# EAGLE design avrusb500 (EAGLE 6.1)
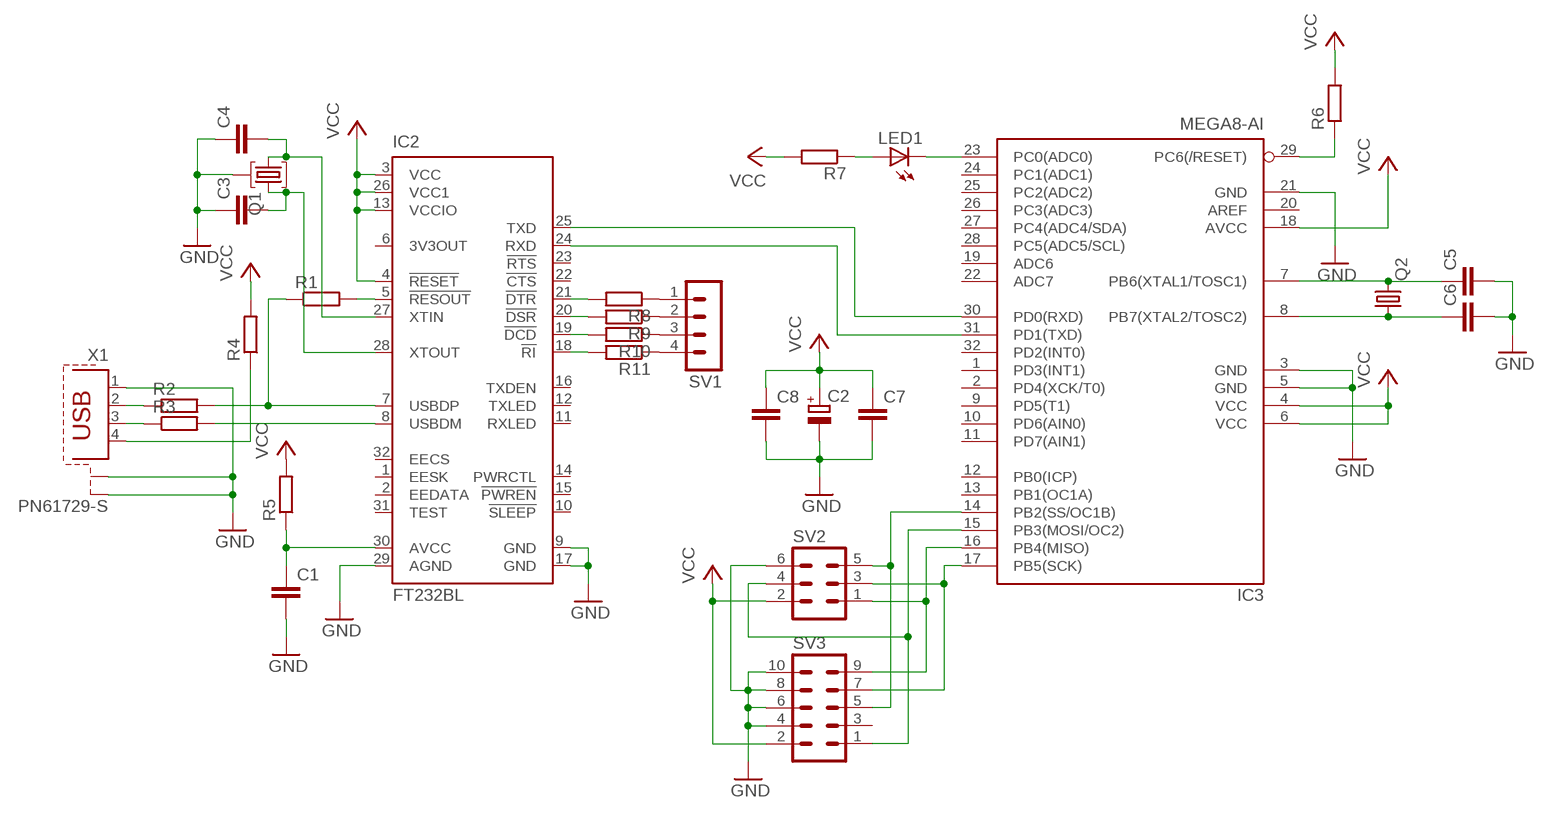
[diagram p0: schematic, sheet 1]

## Parts
C1  C-EUC0805  [C0805]
C2  CPOL-EUSMCB  [SMC_B]
C3  C-EUC0805  [C0805]
C4  C-EUC0805  [C0805]
C5  C-EUC0805  [C0805]
C6  C-EUC0805  [C0805]
C7  C-EUC0805  [C0805]
C8  C-EUC0805  [C0805]
IC2  FT232BL  [LQFP32-7X7]
IC3  MEGA8-AI  [TQFP32-08]
LED1  LED5MM  [LED5MM]
Q1  HC49TL-H  [HC49TL-H]
Q2  CRYSTALHC49UP  [HC49UP]
R1  R-EU_R0805  [R0805]
R2  R-EU_R0805  [R0805]
R3  R-EU_R0805  [R0805]
R4  R-EU_R0805  [R0805]
R5  R-EU_R0805  [R0805]
R6  R-EU_R0805  [R0805]
R7  R-EU_R0805  [R0805]
R8  R-EU_R0805  [R0805]
R9  R-EU_R0805  [R0805]
R10  R-EU_R0805  [R0805]
R11  R-EU_R0805  [R0805]
SV1  MA04-1  [MA04-1]
SV2  ML6L  [ML6L]
SV3  ML10L  [ML10L]
X1  PN61729-S  [PN61729-S]

## Nets
GND: C1.2 C2.- C3.1 C4.1 C5.2 C6.2 C7.2 C8.2 IC2.9(GND) IC2.17(GND) IC2.29(AGND) IC3.3(GND) IC3.5(GND) IC3.21(GND) Q1.3 SV2.6 SV3.4 SV3.6 SV3.8 SV3.10 X1.1 X1.S1 X1.S2
N$1: IC2.5(!RESOUT) R1.2
N$2: IC2.7(USBDP) R1.1 R2.2
N$3: IC2.8(USBDM) R3.2
N$4: R2.1 X1.2
N$5: R3.1 X1.3
N$6: R4.1 X1.4
N$7: C1.1 IC2.30(AVCC) R5.1
N$8: C4.2 IC2.27(XTIN) Q1.1
N$9: C3.2 IC2.28(XTOUT) Q1.2
N$10: IC2.21(!DTR) R8.2
N$11: IC2.25(TXD) IC3.30(PD0(RXD))
N$12: IC2.24(RXD) IC3.31(PD1(TXD))
N$13: C5.1 IC3.7(PB6(XTAL1/TOSC1)) Q2.2
N$14: C6.1 IC3.8(PB7(XTAL2/TOSC2)) Q2.1
N$15: IC3.29(PC6(/RESET)) R6.1
N$16: IC3.15(PB3(MOSI/OC2)) SV2.4 SV3.1
N$17: IC3.16(PB4(MISO)) SV2.1 SV3.9
N$18: IC3.17(PB5(SCK)) SV2.3 SV3.7
N$19: IC3.14(PB2(SS/OC1B)) SV2.5 SV3.5
N$20: IC2.20(!DSR) R9.2
N$21: IC2.19(!DCD) R10.2
N$22: IC2.18(!RI) R11.2
N$23: R8.1 SV1.1
N$24: LED1.A R7.1
N$25: IC3.23(PC0(ADC0)) LED1.K(C)
N$26: R9.1 SV1.2
N$27: R10.1 SV1.3
N$28: R11.1 SV1.4
VCC: C2.+ C7.1 C8.1 IC2.3(VCC) IC2.4(!RESET) IC2.13(VCCIO) IC2.26(VCC1) IC3.4(VCC) IC3.6(VCC) IC3.18(AVCC) R4.2 R5.2 R6.2 R7.2 SV2.2 SV3.2
Unconnected: IC2.1(EESK) IC2.2(EEDATA) IC2.6(3V3OUT) IC2.10(!SLEEP) IC2.11(RXLED) IC2.12(TXLED) IC2.14(PWRCTL) IC2.15(!PWREN) IC2.16(TXDEN) IC2.22(!CTS) IC2.23(!RTS) IC2.31(TEST) IC2.32(EECS) IC3.1(PD3(INT1)) IC3.2(PD4(XCK/T0)) IC3.9(PD5(T1)) IC3.10(PD6(AIN0)) IC3.11(PD7(AIN1)) IC3.12(PB0(ICP)) IC3.13(PB1(OC1A)) IC3.19(ADC6) IC3.20(AREF) IC3.22(ADC7) IC3.24(PC1(ADC1)) IC3.25(PC2(ADC2)) IC3.26(PC3(ADC3)) IC3.27(PC4(ADC4/SDA)) IC3.28(PC5(ADC5/SCL)) IC3.32(PD2(INT0)) SV3.3

## Library data of the parts
C1 C3-C8 = resistor:C-EU: CAPACITOR, European symbol
C2 = resistor:CPOL-EU: POLARIZED CAPACITOR, European symbol
IC2 = ftdichip:FT232B: USB to serial UART interface Source: DS_FT232BL_BQ.pdf; MF: FARNELL; MPN: FT232BL/TR; OC_FARNELL: unknown; OC_NEWARK: 38K1551
IC3 = atmel:MEGA8: MICROCONTROLLER 8 Kbytes FLASH, 1 kbytes SRAM, 512 bytes EEPROM, USART, 6-channel 10 bit ADC, 2-channel 8 bit ADC Pin compatible with Atmega48, ATMega88, ATMega168 Source: avr.lbr; MPN: ATMEGA8-16AU; OC_FARNELL: 9171371; OC_NEWARK: 73M8863
LED1 = led:LED: LED OSRAM: - CHIPLED LG R971, LG N971, LY N971, LG Q971, LY Q971, LO R971, LY R971 LH N974, LH R974 LS Q976, LO Q976, LY Q976 LO Q996 - Hyper CHIPLED LW Q18S LB Q993, LB Q99A, LB R99A - SideLED LS A670, LO A670, LY A670, LG A670, LP A670 LB A673, LV A673, LT A673, LW A673 LH A674 LY A675 LS A676, LA A676, LO A676, LY A676, LW A676 LS A679, LY A679, LG A679 - Hyper Micro SIDELED® LS Y876, LA Y876, LO Y876, LY Y876 LT Y87S - SmartLED LW L88C, LW L88S LB L89C, LB L89S, LG L890 LS L89K, LO L89K, LY L89K LS L896, LA L896, LO L896, LY L896 - TOPLED LS T670, LO T670, LY T670, LG T670, LP T670 LSG T670, LSP T670, LSY T670, LOP T670, LYG T670 LG T671, LOG T671, LSG T671 LB T673, LV T673, LT T673, LW T673 LH T674 LS T676, LA T676, LO T676, LY T676, LB T676, LH T676, LSB T676, LW T676 LB T67C, LV T67C, LT T67C, LS T67K, LO T67K, LY T67K, LW E67C LS E67B, LA E67B, LO E67B, LY E67B, LB E67C, LV E67C, LT E67C LW T67C LS T679, LY T679, LG T679 LS T770, LO T770, LY T770, LG T770, LP T770 LB T773, LV T773, LT T773, LW T773 LH T774 LS E675, LA E675, LY E675, LS T675 LS T776, LA T776, LO T776, LY T776, LB T776 LHGB T686 LT T68C, LB T68C - Hyper Mini TOPLED® LB M676 - Mini TOPLED Santana® LG M470 LS M47K, LO M47K, LY M47K Source: http://www.osram.convergy.de LUXEON: - LUMILED® LXK2-PW12-R00, LXK2-PW12-S00, LXK2-PW14-U00, LXK2-PW14-V00 LXK2-PM12-R00, LXK2-PM12-S00, LXK2-PM14-U00 LXK2-PE12-Q00, LXK2-PE12-R00, LXK2-PE12-S00, LXK2-PE14-T00, LXK2-PE14-U00 LXK2-PB12-K00, LXK2-PB12-L00, LXK2-PB12-M00, LXK2-PB14-N00, LXK2-PB14-P00, LXK2-PB14-Q00 LXK2-PR12-L00, LXK2-PR12-M00, LXK2-PR14-Q00, LXK2-PR14-R00 LXK2-PD12-Q00, LXK2-PD12-R00, LXK2-PD12-S00 LXK2-PH12-R00, LXK2-PH12-S00 LXK2-PL12-P00, LXK2-PL12-Q00, LXK2-PL12-R00 Source: www.luxeon.com KINGBRIGHT: KA-3528ASYC Source: www.kingbright.com
Q1 = crystal:HC49TL-H: CRYSTAL; OC_FARNELL: unknown; OC_NEWARK: unknown
Q2 = crystal:CRYSTAL: CRYSTAL; OC_FARNELL: unknown; OC_NEWARK: unknown
R1-R11 = resistor:R-EU_: RESISTOR, European symbol
SV1 = con-lstb:MA04-1: PIN HEADER; OC_FARNELL: unknown; OC_NEWARK: unknown
SV2 = con-ml:ML6L: HARTING; OC_FARNELL: unknown; OC_NEWARK: unknown
SV3 = con-ml:ML10L: HARTING; OC_FARNELL: unknown; OC_NEWARK: unknown
X1 = con-berg:PN61729-S: BERG USB connector; OC_FARNELL: unknown; OC_NEWARK: unknown

## Board
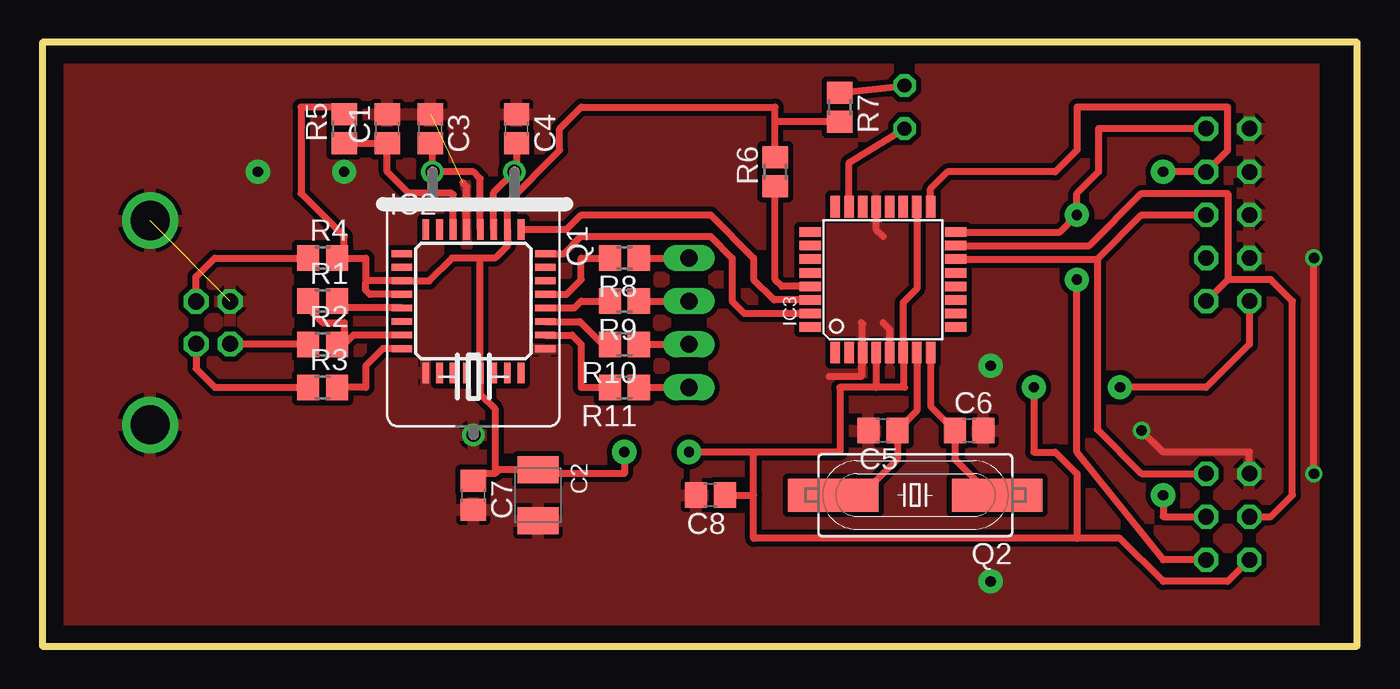
[diagram p1: board, top side]
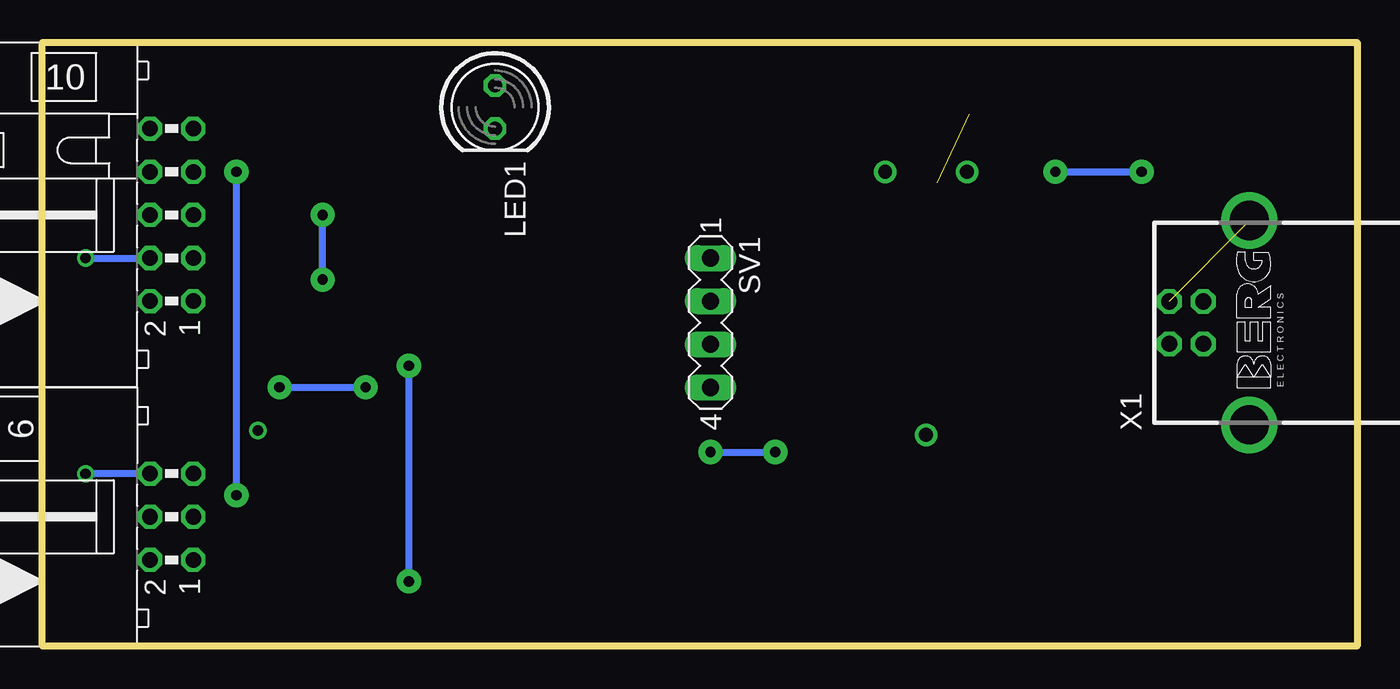
[diagram p2: board, bottom side, seen from below]

Size 77.47 x 35.56 mm. Coordinates in mm from the lower left corner, seen from the top.
Outline: 0,0 77.47,0 77.47,35.56 0,35.56 0,0
Copper layers (1*16): Top 0.035mm / dielectric 1.5mm / Bottom 0.035mm
Design rules: minimum track width 10mil, minimum drill 24mil, track to track 8mil, track to pad 8mil, pad to pad 8mil, via to via 8mil, smd to smd 8mil, copper to edge 40mil, drill to drill 8mil, minimum pad ring 10mil, minimum via ring 8mil, stop-mask expansion 4mil, vias tented up to drill 0mil, thermal gap 10mil

### Footprints (pad centres in the part's own frame; a part is rotated, then mirrored left to right if it is on the bottom)
C0805 = smd 1.3 x 1.5: 1 -0.85,0; 2 0.85,0
SMC_B = smd 1.6 x 2.4: + -1.5,0; - 1.5,0
LQFP32-7X7 = smd 1.2 x 0.4: 1 -4.225,2.8; 2 -4.225,2; 3 -4.225,1.2; 4 -4.225,0.4; 5 -4.225,-0.4; 6 -4.225,-1.2; 7 -4.225,-2; 8 -4.225,-2.8; 17 4.225,-2.8; 18 4.225,-2; 19 4.225,-1.2; 20 4.225,-0.4; 21 4.225,0.4; 22 4.225,1.2; 23 4.225,2; 24 4.225,2.8 | smd 0.4 x 1.2: 9 -2.8,-4.225; 10 -2,-4.225; 11 -1.2,-4.225; 12 -0.4,-4.225; 13 0.4,-4.225; 14 1.2,-4.225; 15 2,-4.225; 16 2.8,-4.225; 25 2.8,4.225; 26 2,4.225; 27 1.2,4.225; 28 0.4,4.225; 29 -0.4,4.225; 30 -1.2,4.225; 31 -2,4.225; 32 -2.8,4.225
TQFP32-08 = smd 1.27 x 0.559: 1 -4.293,2.8; 2 -4.293,2; 3 -4.293,1.2; 4 -4.293,0.4; 5 -4.293,-0.4; 6 -4.293,-1.2; 7 -4.293,-2; 8 -4.293,-2.8; 17 4.293,-2.8; 18 4.293,-2; 19 4.293,-1.2; 20 4.293,-0.4; 21 4.293,0.4; 22 4.293,1.2; 23 4.293,2; 24 4.293,2.8 | smd 0.559 x 1.27: 9 -2.8,-4.293; 10 -2,-4.293; 11 -1.2,-4.293; 12 -0.4,-4.293; 13 0.4,-4.293; 14 1.2,-4.293; 15 2,-4.293; 16 2.8,-4.293; 25 2.8,4.293; 26 2,4.293; 27 1.2,4.293; 28 0.4,4.293; 29 -0.4,4.293; 30 -1.2,4.293; 31 -2,4.293; 32 -2.8,4.293
LED5MM = drill 0.813 octagon: A -1.27,0; K 1.27,0
HC49TL-H = drill 0.813: 1 -2.413,-7.62; 2 2.413,-7.62; 3 0,7.874
HC49UP = smd 5.334 x 1.93: 1 -4.826,0; 2 4.826,0
R0805 = smd 1.3 x 1.5: 1 -0.85,0; 2 0.85,0
MA04-1 = drill 1.016 long: 1 -3.81,0; 2 -1.27,0; 3 1.27,0; 4 3.81,0
ML6L = drill 0.914 octagon: 1 -2.54,-1.27; 2 -2.54,1.27; 3 0,-1.27; 4 0,1.27; 5 2.54,-1.27; 6 2.54,1.27
ML10L = drill 0.914 octagon: 1 -5.08,-1.27; 2 -5.08,1.27; 3 -2.54,-1.27; 4 -2.54,1.27; 5 0,-1.27; 6 0,1.27; 7 2.54,-1.27; 8 2.54,1.27; 9 5.08,-1.27; 10 5.08,1.27
PN61729-S = drill 0.95 octagon: 1 1.25,4.71; 2 -1.25,4.71; 3 -1.25,2.71; 4 1.25,2.71 | drill 2.3 pad 2.9: S1 -6.02,0; S2 6.02,0

### Placement (x,y rotation side)
C1  20.32,30.48 90 top
C2  29.21,8.89 270 top
C3  22.86,30.48 270 top
C4  27.94,30.48 270 top
C5  49.53,12.7 180 top
C6  54.61,12.7 0 top
C7  25.4,8.89 270 top
C8  39.37,8.89 180 top
IC2  25.4,20.32 0 top
IC3  49.53,21.59 90 top
LED1  50.8,31.75 270 bottom
Q1  25.4,20.32 180 top
Q2  51.44,8.89 180 top
R1  16.51,20.32 0 top
R2  16.51,17.78 0 top
R3  16.51,15.24 0 top
R4  16.51,22.86 0 top
R5  17.78,30.48 90 top
R6  43.18,27.94 90 top
R7  46.99,31.75 270 top
R8  34.29,22.86 180 top
R9  34.29,20.32 180 top
R10  34.29,17.78 180 top
R11  34.29,15.24 180 top
SV1  38.1,19.05 270 bottom
SV2  69.85,7.62 90 bottom
SV3  69.85,25.4 90 bottom
X1  6.35,19.05 90 bottom

### Tracks (layer width: path | path; a pad name or v marks a point on that pad's centre or on a via)
GND  (via drill 0.6, 0.6 pad 1.42)  (2 unrouted)
  Top 0.406: 46.35,15.88 48.26,15.88 48.26,16.51 48.33,16.58 IC3.3 48.33,18.98 48.26,19.05 | IC3.5 49.93,18.65 49.53,19.05 | IC3.21 49.13,24.53 49.53,24.13 | v64.77,12.7 66.04,11.43 71.12,11.43 SV2.6 | v74.93,10.16 v74.93,22.86 | IC2.29 25,27.07 24.77,27.3
  Bottom 0.406: v55.88,16.51 v55.88,3.81 | v17.78,27.94 v12.7,27.94 | v74.93,22.86 SV3.4 | SV2.6 v74.93,10.16
  pour Top (isolate 0.305): 1.27,1.27 74.93,1.27 74.93,34.29 1.27,34.29
N$1
  Top 0.406: IC2.5 17.76,19.92 R1.2
N$2
  Top 0.406: IC2.7 18.32,18.32 17.78,17.78 R2.2 17.78,18.2 17.78,19.05 16.51,19.05 15.66,19.9 R1.1
N$3
  Top 0.406: IC2.8 20.06,17.52 19.05,16.51 19.05,15.24 R3.2
N$4
  Top 0.406: X1.2 15.66,17.8 R2.1
N$5
  Top 0.406: X1.3 9.06,16.34 10.16,15.24 R3.1
N$6
  Top 0.406: X1.4 9.06,21.76 10.16,22.86 R4.1
N$7
  Top 0.406: IC2.30 24.2,26.6 24.13,26.67 21.59,26.67 20.32,27.94 C1.1 R5.1
N$8
  Top 0.406: IC2.27 26.6,26.73 Q1.1 27.94,28.07 C4.2
N$9
  Top 0.406: IC2.28 25.8,27.54 25.4,27.94 Q1.2 22.99,29.5 C3.2
N$10
  Top 0.406: IC2.21 30.88,20.72 31.75,21.59 31.75,22.86 R8.2
N$11
  Top 0.406: IC2.25 30.89,24.55 31.75,25.4 39.37,25.4 41.91,22.86 41.91,21.59 43.11,20.39 IC3.30
N$12
  Top 0.406: IC2.24 30.74,23.12 31.75,24.13 39.37,24.13 40.64,22.86 40.64,20.32 41.37,19.59 IC3.31
N$13
  Top 0.406: IC3.7 51.53,13.85 C5.1 50.38,11.01 48.26,8.89 Q2.2
N$14
  Top 0.406: IC3.8 52.33,14.13 C6.1 53.76,11.01 55.88,8.89 Q2.1
N$15
  Top 0.406: IC3.29 43.58,21.19 43.18,21.59 R6.1
N$16
  Top 0.406: IC3.15 61.69,23.59 64.77,26.67 69.85,26.67 69.85,21.59 | 69.85,21.59 SV3.1 | SV2.4 72.39,7.62 73.66,8.89 73.66,20.32 72.39,21.59 69.85,21.59
N$17  (via drill 0.6 pad 1.42)
  Top 0.406: SV3.9 62.23,30.48 62.23,27.94 60.96,26.67 v60.96,25.4 59.95,24.39 IC3.16 | SV2.1 66.04,5.08 60.96,11.43 v60.96,21.59
  Bottom 0.406: v60.96,21.59 v60.96,25.4
N$18  (via drill 0.6, 0.6 pad 1.42)
  Top 0.406: IC3.17 52.33,26.93 53.34,27.94 59.69,27.94 60.96,29.21 60.96,31.75 69.85,31.75 69.85,29.21 SV3.7 v66.04,27.94 | v66.04,8.89 66.04,7.62 SV2.3
  Bottom 0.406: v66.04,27.94 v66.04,8.89
N$19
  Top 0.406: IC3.14 62.16,22.79 | 62.16,22.79 64.77,25.4 SV3.5 | 62.16,22.79 62.16,12.77 64.77,10.16 SV2.5
N$20
  Top 0.406: IC2.20 31.35,19.92 31.75,20.32 R9.2
N$21
  Top 0.406: IC2.19 31.68,19.12 33.02,17.78 R10.2
N$22
  Top 0.406: IC2.18 31.21,18.32 31.75,17.78 31.75,15.24 R11.2
N$23
  Top 0.406: R8.1 SV1.1
N$24
  Top 0.406: R7.1 LED1.A
N$25
  Top 0.406: IC3.23 47.53,28.48 LED1.K
N$26
  Top 0.406: R9.1 SV1.2
N$27
  Top 0.406: R10.1 SV1.3
N$28
  Top 0.406: R11.1 SV1.4
VCC  (via drill 0.6 pad 1.42)
  Top 0.406: 17.78,22.86 19.05,22.86 19.05,21.59 19.12,21.52 | 19.12,21.52 IC2.3 22.79,21.52 24.13,22.86 25.8,22.86 | IC2.4 19.29,20.72 19.05,20.95 19.05,21.45 19.12,21.52 | 25.8,22.86 26.67,22.86 27.4,23.59 IC2.26 27.4,26.13 30.48,29.21 30.48,30.48 31.75,31.75 43.18,31.75 43.18,30.9 | 25.8,22.86 IC2.13 25.8,14.84 26.67,13.97 26.67,10.16 | R5.2 17.78,31.75 15.24,31.75 15.24,26.67 17.78,24.13 17.78,22.86 | 17.78,22.86 R4.2 | R6.2 43.18,30.9 | 26.67,10.16 25.82,10.16 C7.1 | 26.67,10.16 26.9,10.39 C2.+ 29.21,10.16 34.29,10.16 v34.29,11.43 | 49.13,15.24 50.8,15.24 50.73,15.31 IC3.6 50.73,20.25 51.53,21.05 IC3.18 | 49.13,15.24 46.99,15.24 46.99,11.43 41.91,11.43 | IC3.4 49.13,15.24 | SV3.2 71.12,17.78 68.58,15.24 v63.5,15.24 | SV2.2 69.85,3.81 66.04,3.81 63.5,6.35 60.96,6.35 | 60.96,6.35 41.91,6.35 41.91,8.89 | 41.91,8.89 41.91,11.43 | 41.91,11.43 v38.1,11.43 | R7.2 43.18,30.9 | C8.1 41.91,8.89 | v58.42,15.24 58.42,11.43 59.69,11.43 60.96,10.16 60.96,6.35
  Bottom 0.406: v63.5,15.24 v58.42,15.24 | v38.1,11.43 v34.29,11.43